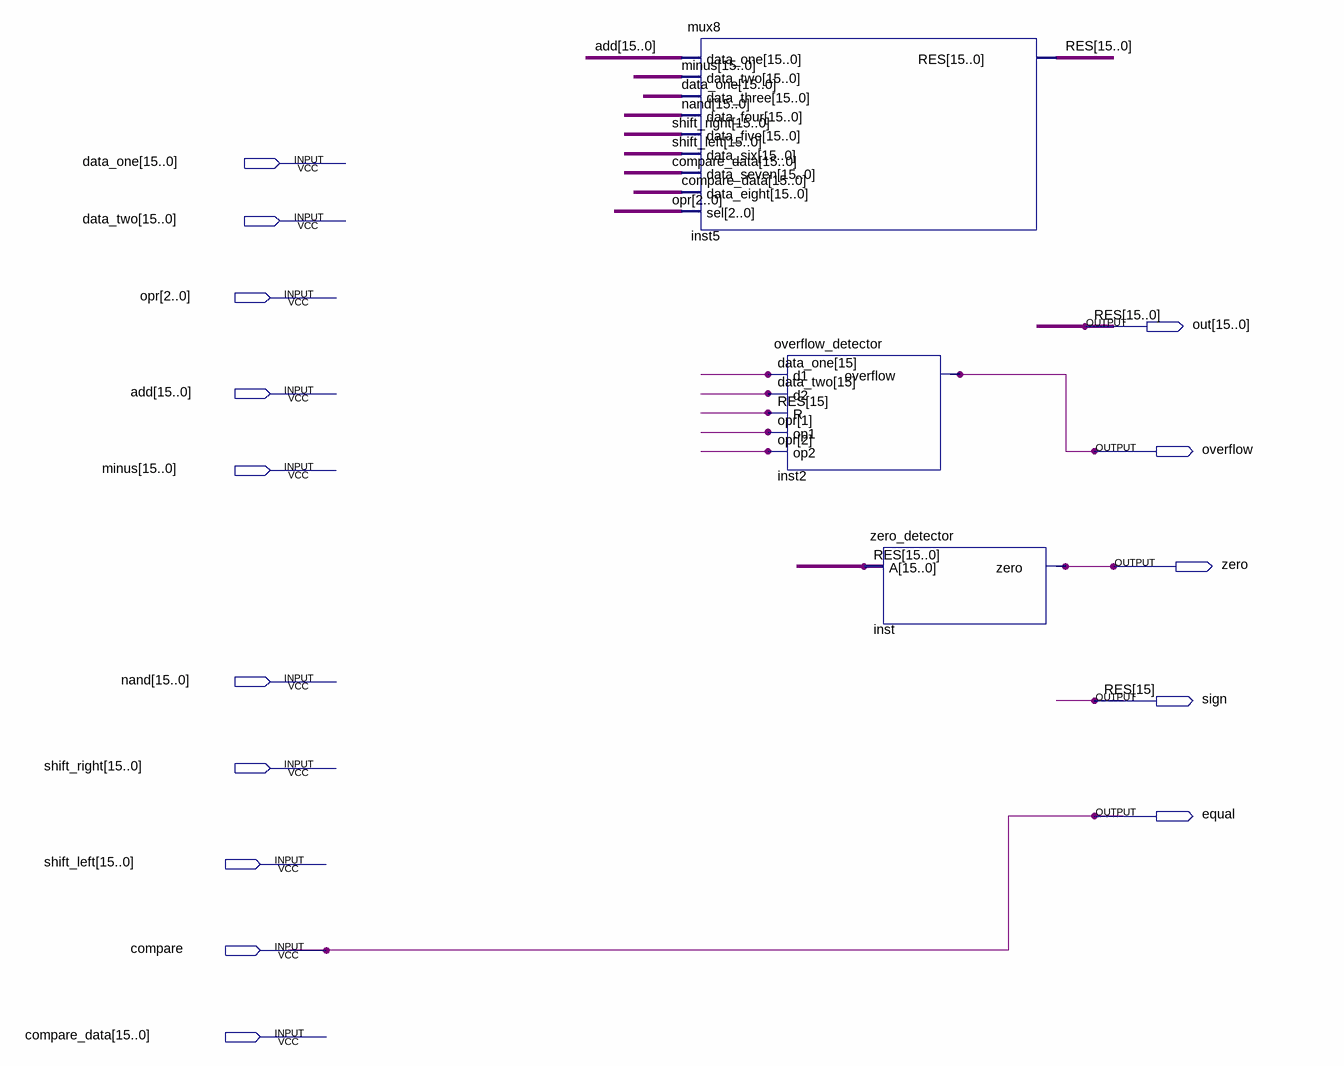
[diagram p0: schematic sheet]
// Quartus schematic setter.bdf as structural Verilog: 3 symbols, 15 pins
module setter (
  input  [15:0] data_one,
  input  [15:0] data_two,
  input  [2:0] opr,
  input  [15:0] add,
  input  [15:0] minus,
  input  [15:0] \nand ,
  input  [15:0] shift_right,
  input  [15:0] shift_left,
  input  compare,
  input  [15:0] compare_data,
  output [15:0] out,
  output overflow,
  output zero,
  output sign,
  output equal
);

  mux8 inst5 (
    .data_one(add), .data_two(minus), .data_three(data_one), .data_four(\nand ), .data_five(shift_right),
    .data_six(shift_left), .data_seven(compare_data), .data_eight(compare_data), .sel(opr), .RES(out));
  overflow_detector inst2 (
    .d1(data_one[15]), .d2(data_two[15]), .R(out[15]), .op1(opr[1]), .op2(opr[2]), .overflow(overflow));
  zero_detector inst (.A(out), .zero(zero));

  assign equal = compare;
  assign sign = out[15];

  // Other names for the same wires on the sheet: RES[15:0] = out
endmodule
